# Altium schematic sheet Boot Switches.SchDoc
size A4; SheetNumber: 9; SheetTotal: 10
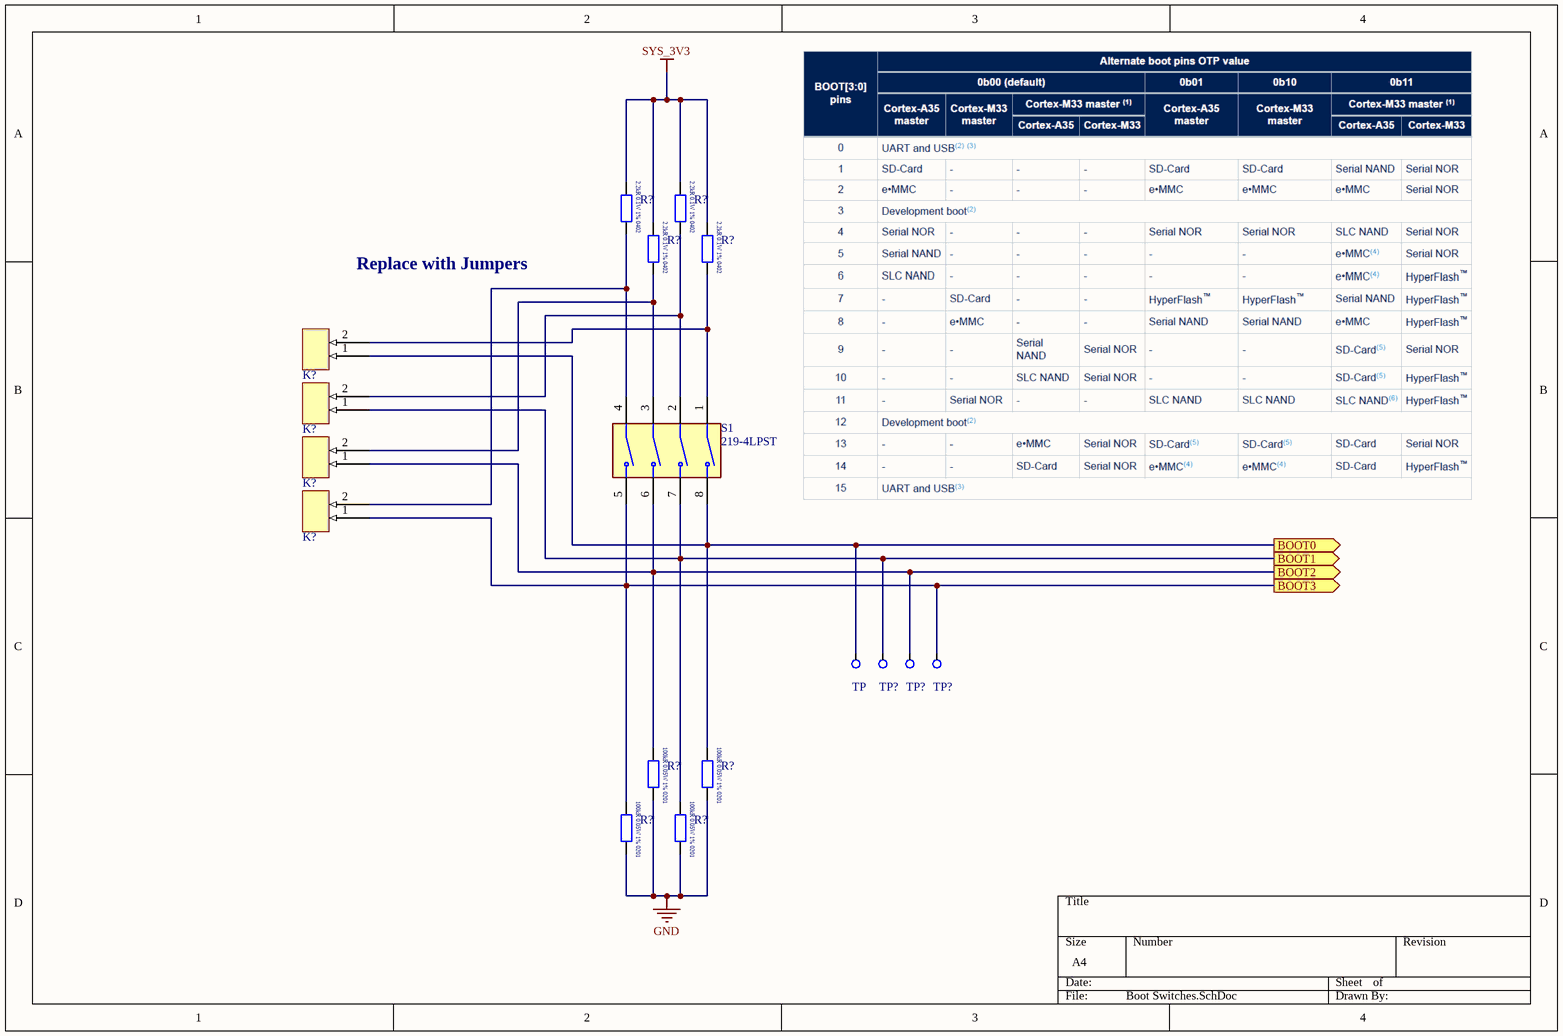
[diagram p0: Boot Switches.SchDoc]

## Parts
(Parts that share a designator on the sheet are numbered #1, #2 ... from top to bottom, then left to right.)
K?#1  TSW-102-07-F-S  [SAMTEC_TSW-102-07-F-S]  (value not drawn)
K?#2  TSW-102-07-F-S  [SAMTEC_TSW-102-07-F-S]  (value not drawn)
K?#3  TSW-102-07-F-S  [SAMTEC_TSW-102-07-F-S]  (value not drawn)
K?#4  TSW-102-07-F-S  [SAMTEC_TSW-102-07-F-S]  (value not drawn)
R?#1  ERJ-2RKF2201X  [RESC1005X04N]  (value not drawn)
R?#2  ERJ-2RKF2201X  [RESC1005X04N]  (value not drawn)
R?#3  ERJ-2RKF2201X  [RESC1005X04N]  (value not drawn)
R?#4  ERJ-2RKF2201X  [RESC1005X04N]  (value not drawn)
R?#5  RK73H1ETTP1003F  [RESC1005X04N]  (value not drawn)
R?#6  RK73H1ETTP1003F  [RESC1005X04N]  (value not drawn)
R?#7  RK73H1ETTP1003F  [RESC1005X04N]  (value not drawn)
R?#8  RK73H1ETTP1003F  [RESC1005X04N]  (value not drawn)
S1  219-4LPST  [SW_219-4LPST]
TP  Test Point  [Test Point]  (value not drawn)
TP?#1  Test Point  [Test Point]  (value not drawn)
TP?#2  Test Point  [Test Point]  (value not drawn)
TP?#3  Test Point  [Test Point]  (value not drawn)

## Ports
BOOT0 (out), BOOT1 (out), BOOT2 (out), BOOT3 (out)

## Nets
GND: R?#5.2 R?#6.2 R?#7.2 R?#8.2
SYS_3V3: R?#1.1 R?#2.1 R?#3.1 R?#4.1
BOOT0: K?#1.1 R?#6.1 S1.8 TP.12 ; port BOOT0
BOOT1: K?#2.1 R?#8.1 S1.7 TP?#1.12 ; port BOOT1
BOOT2: K?#3.1 R?#5.1 S1.6 TP?#2.12 ; port BOOT2
BOOT3: K?#4.1 R?#7.1 S1.5 TP?#3.12 ; port BOOT3
NetK?#1_2: K?#1.2 R?#4.2 S1.1
NetK?#2_2: K?#2.2 R?#2.2 S1.2
NetK?#3_2: K?#3.2 R?#3.2 S1.3
NetK?#4_2: K?#4.2 R?#1.2 S1.4

## Notes on the sheet
- Replace with Jumpers
- (in symbol ERJ-2RKF2201X) 2.2kR 0.1W 1% 0402
- (in symbol RK73H1ETTP1003F) 100kR 0.05W 1% 0201

## Library data of the parts
K?#1-K?#4 = TSW-102-07-F-S: Connector Header Through Hole 2 position 0.100" (2.54mm)
R?#1-R?#4 = ERJ-2RKF2201X: RES SMD 2.2K OHM 1% 1/10W 0402
R?#5-R?#8 = RK73H1ETTP1003F: 100 kOhms ±1% 0.1W, 1/10W Chip Resistor 0402 (1005 Metric) Automotive AEC-Q200 Thick Film
S1 = 219-4LPST: Dip Switch SPST 4 Position Surface Mount Slide (Standard) Actuator 100mA 20VDC; MF: {'manufacturer': u'CTS Electrocomponents'}; Package: None; Price: None; Value: *; MP: 219-4LPST; Availability: Unavailable